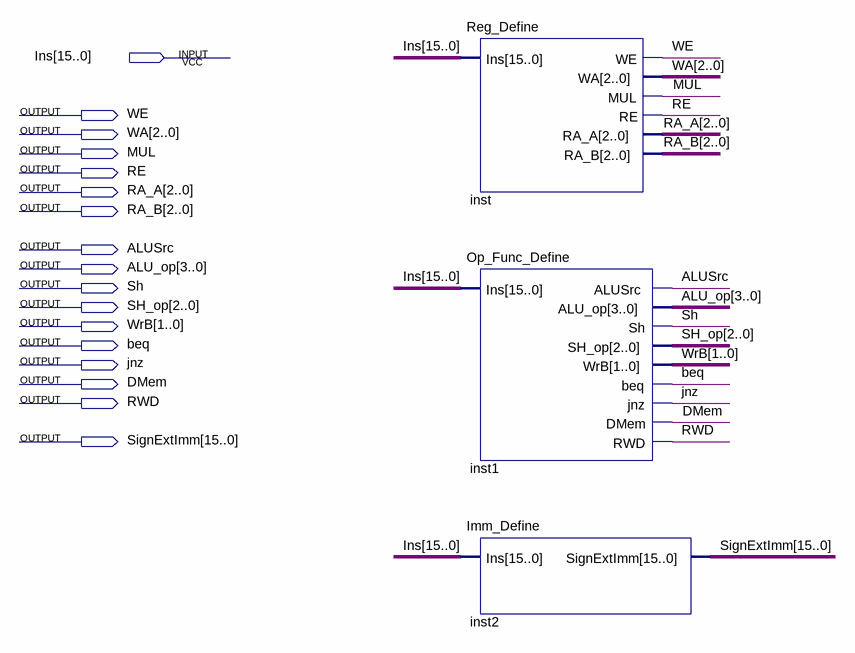
[diagram p0: schematic sheet]
// Quartus schematic Control_Unit.bdf as structural Verilog: 3 symbols, 17 pins
module Control_Unit (
  input  [15:0] Ins,
  output WE,
  output [2:0] WA,
  output MUL,
  output RE,
  output [2:0] RA_A,
  output [2:0] RA_B,
  output ALUSrc,
  output [3:0] ALU_op,
  output Sh,
  output [2:0] SH_op,
  output [1:0] WrB,
  output beq,
  output jnz,
  output DMem,
  output RWD,
  output [15:0] SignExtImm
);

  Reg_Define inst (.Ins(Ins), .WE(WE), .WA(WA), .MUL(MUL), .RE(RE), .RA_A(RA_A), .RA_B(RA_B));
  Op_Func_Define inst1 (
    .Ins(Ins), .ALUSrc(ALUSrc), .ALU_op(ALU_op), .Sh(Sh), .SH_op(SH_op), .WrB(WrB), .beq(beq), .jnz(jnz),
    .DMem(DMem), .RWD(RWD));
  Imm_Define inst2 (.Ins(Ins), .SignExtImm(SignExtImm));
endmodule
